# EAGLE design Control Board (EAGLE 7.6.0)
Control Board
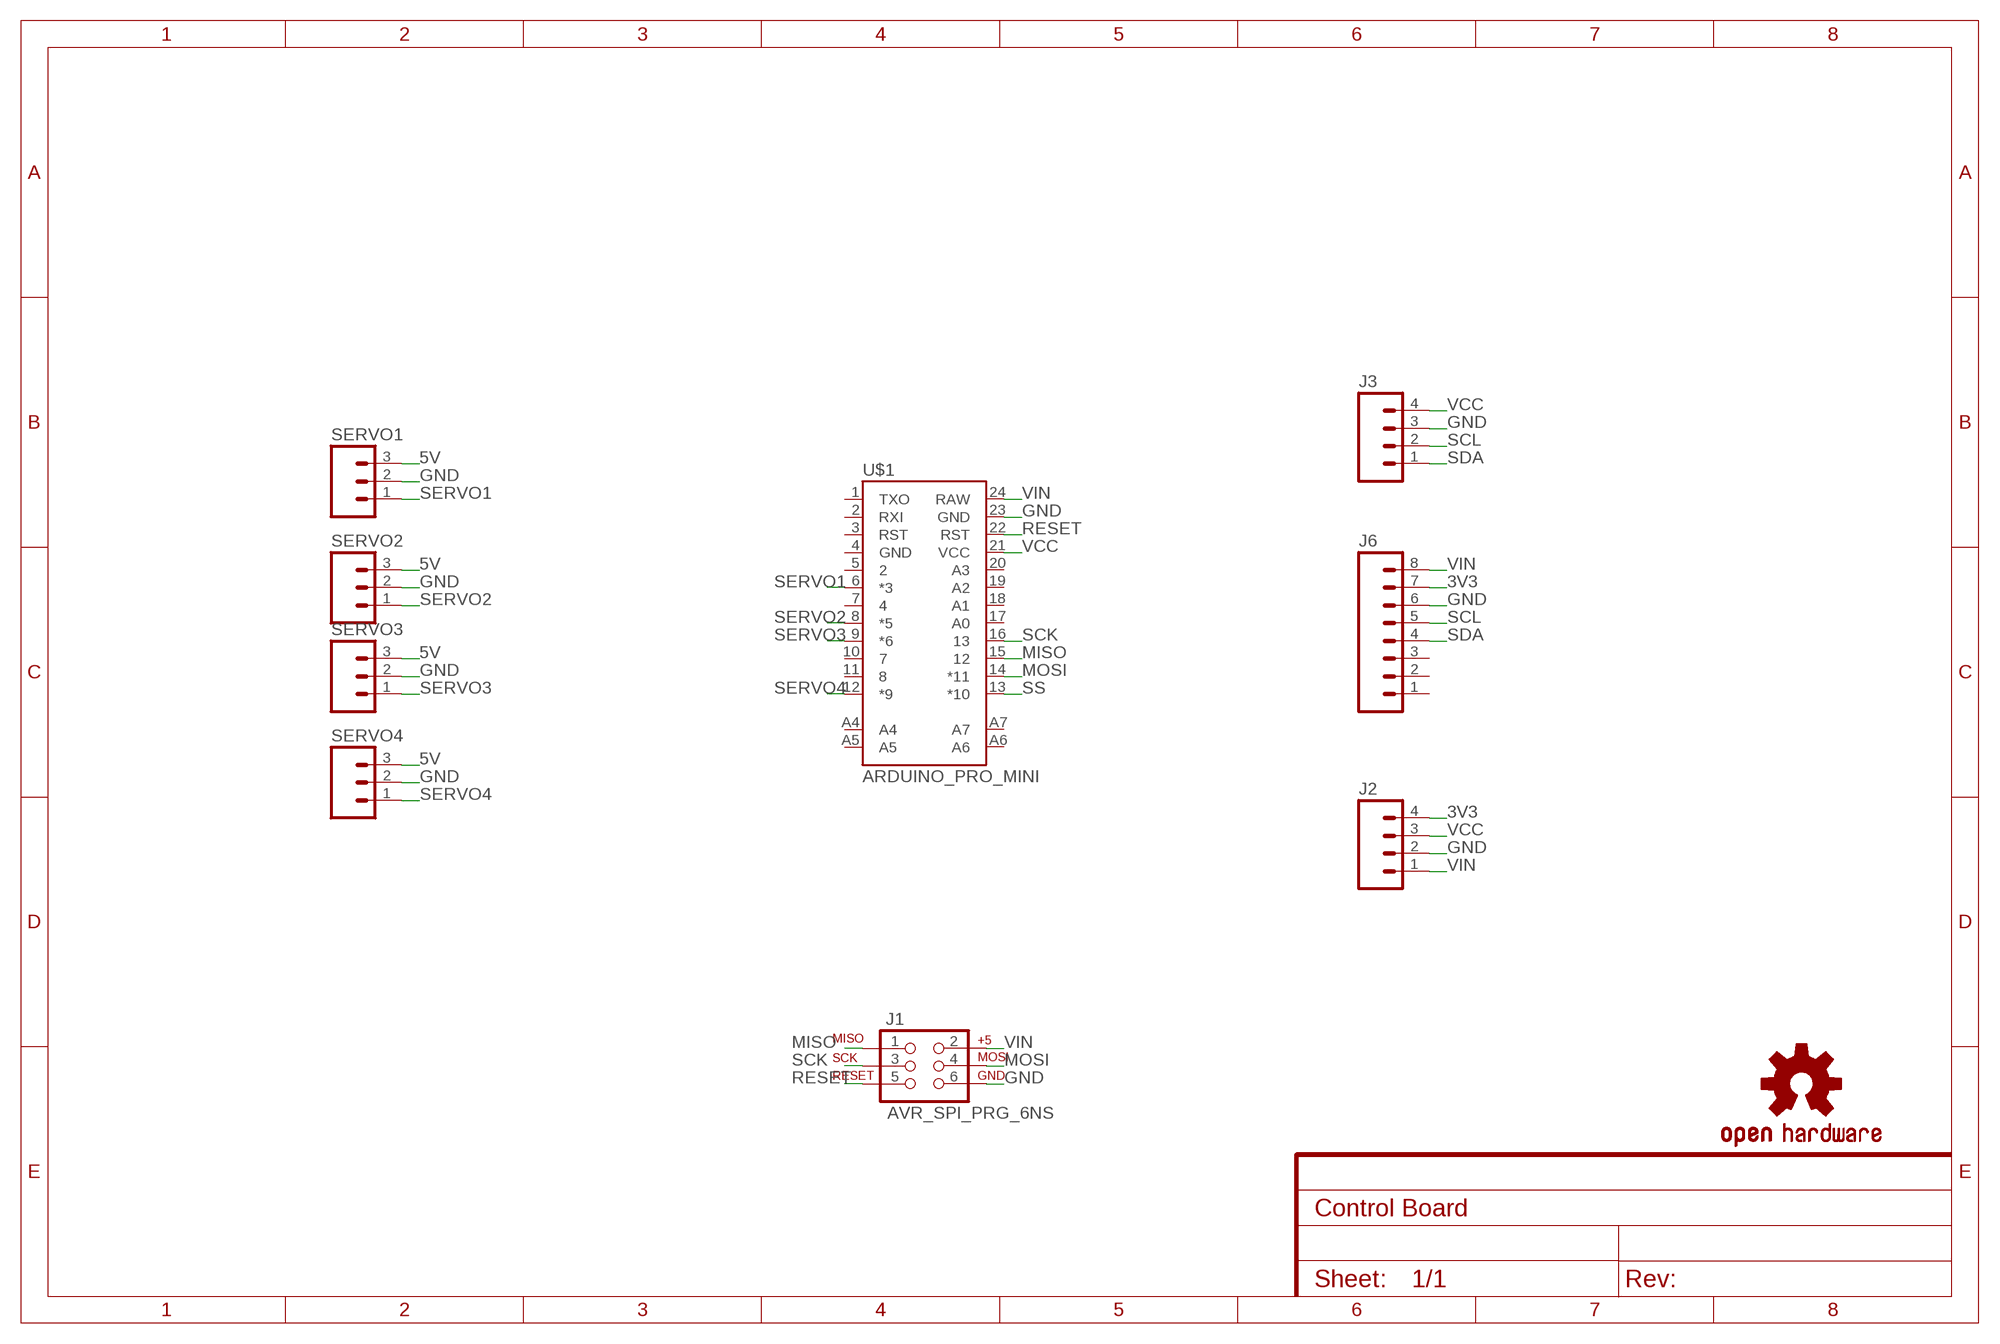
[diagram p0: schematic, sheet 1]

## Parts
J1  AVR_SPI_PRG_6NS  [2X3-NS]
J2  M04PTH  [1X04]
J3  M04PTH  [1X04]
J6  M08  [1X08_ROUND]
LOGO1  OSHW-LOGOM-COPPER  [OSHW-LOGO-M_COPPER]
SERVO1  M03PTH  [1X03]
SERVO2  M03PTH  [1X03]
SERVO3  M03PTH  [1X03]
SERVO4  M03PTH  [1X03]
U$1  ARDUINO_PRO_MINI  [ARDUINO_PRO_MINI]

## Nets
3V3: J2.4 J6.7
5V: SERVO1.3 SERVO2.3 SERVO3.3 SERVO4.3
GND: J1.6 J2.2 J3.3 J6.6 SERVO1.2 SERVO2.2 SERVO3.2 SERVO4.2 U$1.23(GND)
MISO: J1.1 U$1.15
MOSI: J1.4 U$1.14(*11)
RESET: J1.5 U$1.22(RST)
SCK: J1.3 U$1.16
SCL: J3.2 J6.5
SDA: J3.1 J6.4
SERVO1: SERVO1.1 U$1.6(*3)
SERVO2: SERVO2.1 U$1.8(*5)
SERVO3: SERVO3.1 U$1.9(*6)
SERVO4: SERVO4.1 U$1.12(*9)
SS: U$1.13(*10)
VCC: J2.3 J3.4 U$1.21(VCC)
VIN: J1.2 J2.1 J6.8 U$1.24(RAW)
Unconnected: J6.1 J6.2 J6.3 U$1.1(TXO) U$1.2(RXI) U$1.3(RST) U$1.4(GND) U$1.5 U$1.7 U$1.10 U$1.11 U$1.17(A0) U$1.18(A1) U$1.19(A2) U$1.20(A3) U$1.A4 U$1.A5 U$1.A6 U$1.A7

## Library data of the parts
J1 = SparkFun-Connectors:AVR_SPI_PRG_6: AVR ISP 6 Pin This is the reduced ISP connector for AVR programming. Common on Arduino. This footprint will take up less PCB space and can be used with a 10-pin to 6-pin adapter such as SKU: BOB-08508 **Special note about "TEST_POINT" package. The stop mask is on the top side, so if you want your programming test points to be on the bottom of your board, make sure to place this package on the bottom side of the board. This also ensure that the orientation to program from the bottom side will be correct.
J2 J3 = SparkFun-Connectors:M04: Header 4 Standard 4-pin 0.1" header. Use with straight break away headers (SKU : PRT-00116), right angle break away headers (PRT-00553), swiss pins (PRT-00743), machine pins (PRT-00117), and female headers (PRT-00115). Molex polarized connector foot print use with SKU : PRT-08231 with associated crimp pins and housings. 1MM SMD Version SKU: PRT-10208; PROD_ID: CONN-09696
J6 = SparkFun-Connectors:M08: Header 8 Standard 8-pin 0.1" header. Use with straight break away headers (SKU : PRT-00116), right angle break away headers (PRT-00553), swiss pins (PRT-00743), machine pins (PRT-00117), and female headers (PRT-00115).; PROD_ID: CONN-08437
LOGO1 = SparkFun-Aesthetics:OSHW-LOGO: Open Source Hardware Logo This logo indicates the piece of hardware it is found on incorporates a OSHW license and/or adheres to the definition of open source hardware found here: http://freedomdefined.org/OSHW
SERVO1-SERVO4 = SparkFun-Connectors:M03: Header 3 Standard 3-pin 0.1" header. Use with straight break away headers (SKU : PRT-00116), right angle break away headers (PRT-00553), swiss pins (PRT-00743), machine pins (PRT-00117), and female headers (PRT-00115). Molex polarized connector foot print use with SKU : PRT-08232 with associated crimp pins and housings.
U$1 = SparkFun-Boards:ARDUINO_PRO_MINI

## Board
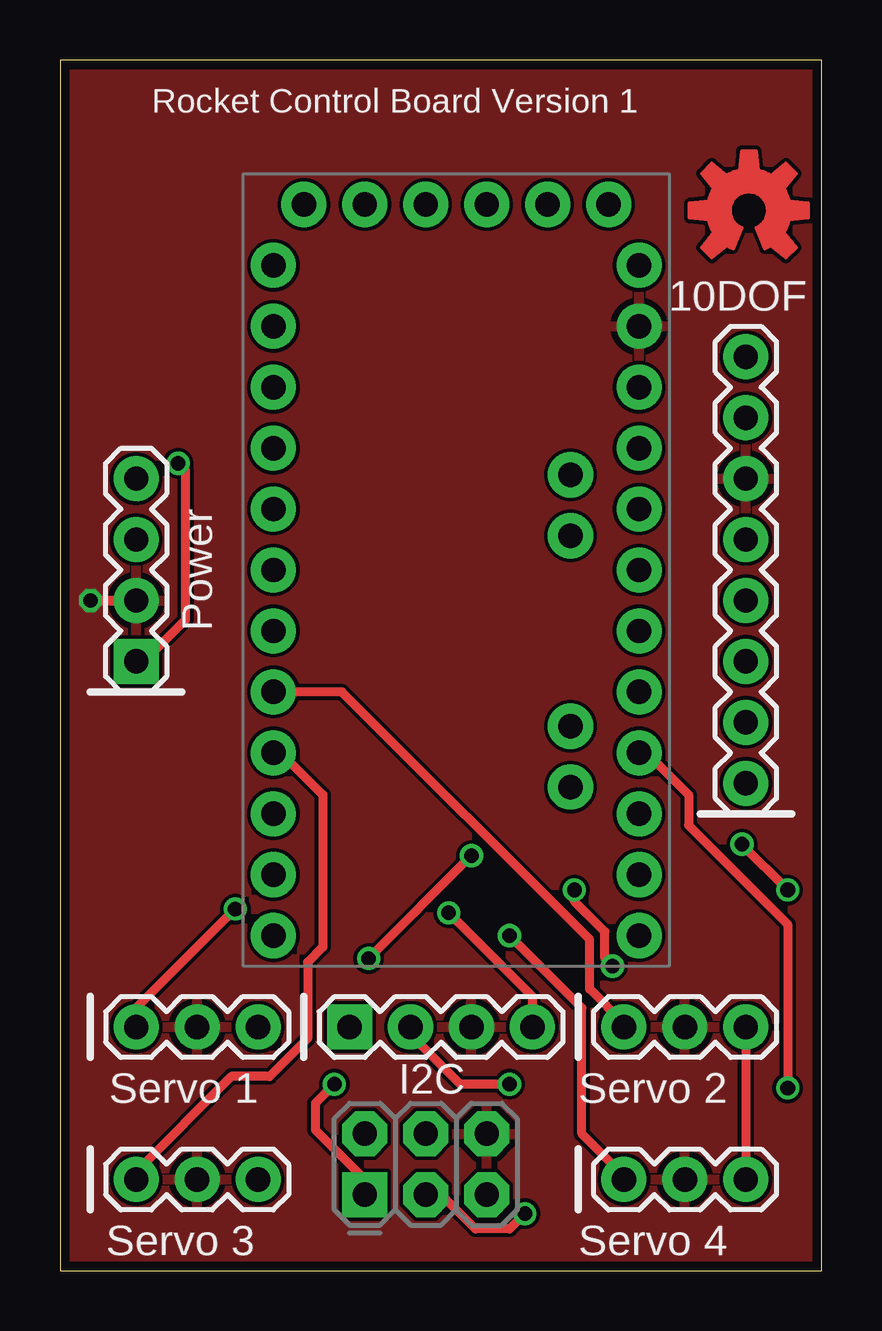
[diagram p1: board, top side]
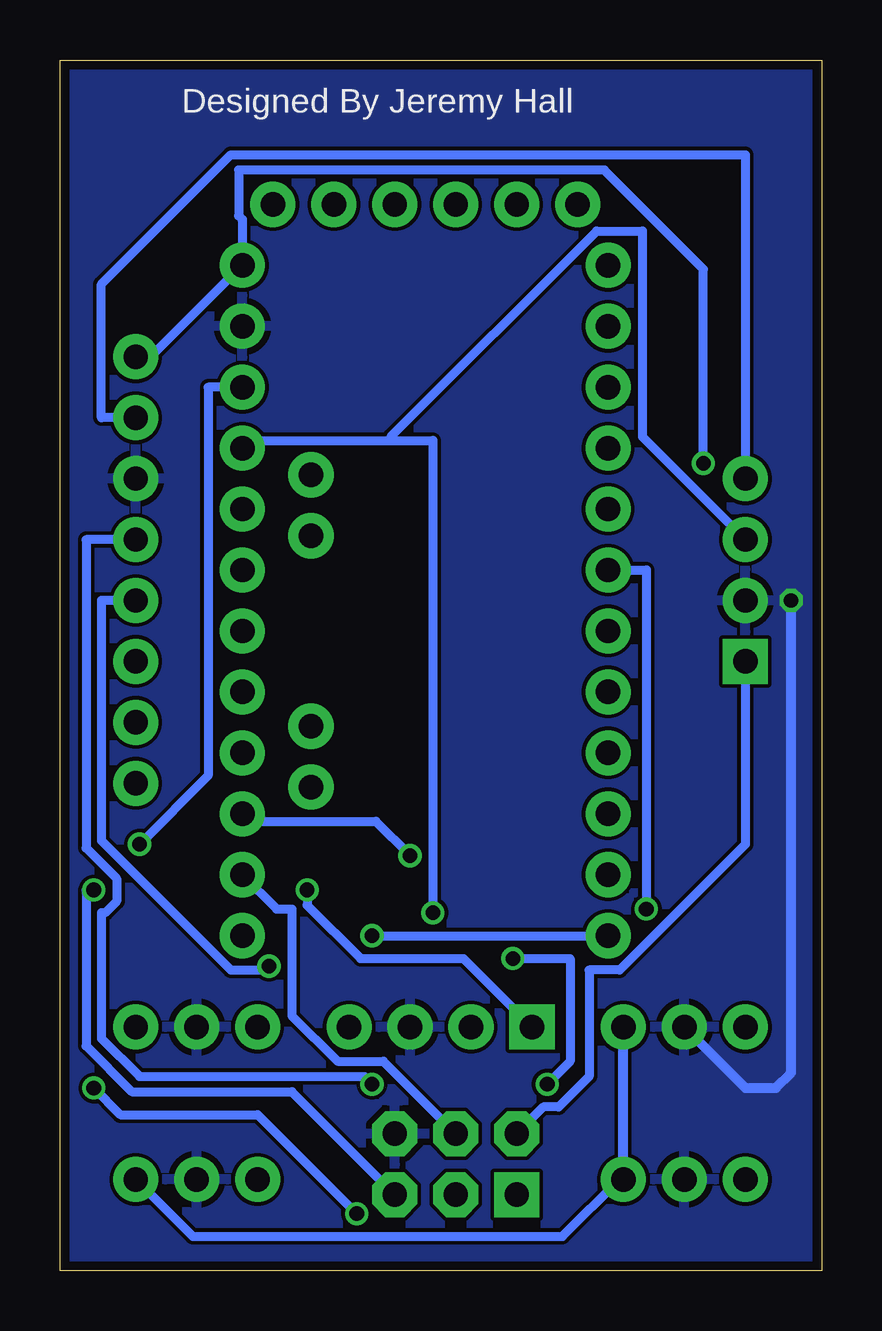
[diagram p2: board, bottom side, seen from below]

Size 31.73 x 50.47 mm. Coordinates in mm from the lower left corner, seen from the top.
Outline: 0,0 31.73,0 31.73,50.47 0,50.47 0,0
Copper layers (1*16): Top 0.0356mm / dielectric 1.5011mm / Bottom 0.0356mm
Design rules "oshpark-2layer": minimum track width 6mil, minimum drill 13mil, track to track 6mil, track to pad 6mil, pad to pad 6mil, via to via 6mil, smd to smd 6mil, copper to edge 15mil, drill to drill 6mil, minimum pad ring 7mil, minimum via ring 7mil, stop-mask expansion 2.5mil, vias tented up to drill 0mil, thermal gap 10mil

### Footprints (pad centres in the part's own frame; a part is rotated, then mirrored left to right if it is on the bottom)
2X3-NS = drill 1.016 pad 1.88 square: 1 -2.54,-1.27 | drill 1.016 pad 1.88 octagon: 2 -2.54,1.27; 3 0,-1.27; 4 0,1.27; 5 2.54,-1.27; 6 2.54,1.27
1X04 = drill 1.016 pad 1.88 square: 1 0,0 | drill 1.016 pad 1.88: 2 2.54,0; 3 5.08,0; 4 7.62,0
1X08_ROUND = drill 1.016 pad 1.88: 1 0,0; 2 2.54,0; 3 5.08,0; 4 7.62,0; 5 10.16,0; 6 12.7,0; 7 15.24,0; 8 17.78,0
1X03 = drill 1.016 pad 1.88: 1 0,0; 2 2.54,0; 3 5.08,0
ARDUINO_PRO_MINI = drill 1.016 pad 1.88: 1 -7.62,12.7; 2 -7.62,10.16; 3 -7.62,7.62; 4 -7.62,5.08; 5 -7.62,2.54; 6 -7.62,0; 7 -7.62,-2.54; 8 -7.62,-5.08; 9 -7.62,-7.62; 10 -7.62,-10.16; 11 -7.62,-12.7; 12 -7.62,-15.24; 13 7.62,-15.24; 14 7.62,-12.7; 15 7.62,-10.16; 16 7.62,-7.62; 17 7.62,-5.08; 18 7.62,-2.54; 19 7.62,0; 20 7.62,2.54; 21 7.62,5.08; 22 7.62,7.62; 23 7.62,10.16; 24 7.62,12.7; A4 4.763,1.429; A5 4.763,3.969; A6 4.763,-9.049; A7 4.763,-6.509; BLK -6.35,15.24; GND -3.81,15.24; GRN 6.35,15.24; RXI 1.27,15.24; TXO 3.81,15.24; VCC -1.27,15.24

### Placement (x,y rotation side)
J1  15.24,4.45 0 top
J2  3.17,25.4 90 top
J3  12.06,10.16 0 top
J6  28.57,20.32 90 top
LOGO1  28.7,44.2 0 top
SERVO1  3.17,10.16 0 top
SERVO2  23.5,10.16 0 top
SERVO3  3.17,3.81 0 top
SERVO4  23.5,3.81 0 top
U$1  16.51,29.21 0 top

### Tracks (layer width: path | path; a pad name or v marks a point on that pad's centre or on a via)
3V3
  Bottom 0.381: J2.4 3.17,46.51 24.61,46.51 30,41.12 30,35.56 J6.7
5V
  Top 0.381: SERVO2.3 SERVO4.3
  Bottom 0.381: SERVO4.3 26.19,1.43 10.79,1.43 8.41,3.81 SERVO3.3
  Bottom 0.406: SERVO3.3 SERVO1.3
GND  (via drill 0.6)
  Top 0.406: v1.27,27.94 J2.2
  Bottom 0.406: SERVO1.2 3.17,7.62 1.91,7.62 1.27,8.26 v1.27,27.94
  pour Top: 0,50.8 31.75,50.8 31.75,0 0,0
  pour Bottom: 0,50.8 31.75,50.8 31.75,0 0,0
MISO  (via drill 0.61)
  Top 0.381: J1.1 12.7,3.81 10.64,5.87 10.64,6.99 v11.43,7.78 | v17.14,17.3 v12.86,13.02
  Bottom 0.381: v11.43,7.78 10.48,8.73 10.48,13.02 v12.86,13.02 | v17.14,17.3 18.57,18.73 23.81,18.73 U$1.15
MOSI
  Bottom 0.381: J1.4 18.26,8.73 20.16,8.73 22.07,10.64 22.07,15.08 22.7,15.08 U$1.14
RESET  (via drill 0.61)
  Top 0.381: v28.42,17.78 v30.32,15.88
  Bottom 0.381: J1.5 22.07,7.46 28.73,7.46 30.64,9.37 30.64,15.88 v30.32,15.88 | v28.42,17.78 25.56,20.64 25.56,36.83 U$1.22
SCK  (via drill 0.61)
  Top 0.381: J1.3 15.88,3.17 17.3,1.75 18.73,1.75 v19.37,2.38 | v30.32,7.62 30.32,14.45 26.19,18.57 26.19,19.84 24.45,21.59 U$1.16
  Bottom 0.381: v19.37,2.38 23.5,6.51 29.21,6.51 v30.32,7.62
SCL  (via drill 0.61)
  Top 0.381: J3.2 14.61,9.84 16.67,7.78 v18.73,7.78
  Bottom 0.381: v18.73,7.78 19.05,8.1 28.42,8.1 30,9.68 30,14.92 29.84,14.92 29.37,15.4 29.37,16.35 30.64,17.62 30.64,30.48 J6.5
SDA  (via drill 0.61)
  Top 0.381: v21.43,15.88 21.43,15.4 22.7,14.13 22.7,13.02 v23.02,12.7
  Bottom 0.381: J3.1 14.92,13.02 19.21,13.02 21.43,15.24 v21.43,15.88 | v23.02,12.7 23.18,12.54 24.61,12.54 30,17.94 30,27.94 J6.4
SERVO1  (via drill 0.61)
  Top 0.381: SERVO1.1 3.17,10.95 v7.3,15.08
  Bottom 0.381: v7.3,15.08 7.3,29.21 U$1.6
SERVO2
  Top 0.381: U$1.8 11.75,24.13 22.07,13.81 22.07,11.75 23.5,10.32 SERVO2.1
SERVO3
  Top 0.381: SERVO3.1 3.17,4.13 7.14,8.1 8.73,8.1 10.32,9.68 10.32,12.86 10.95,13.49 10.95,19.84 9.21,21.59 U$1.9
SERVO4  (via drill 0.61)
  Top 0.381: v18.73,13.97 21.75,10.95 21.75,5.71 23.5,3.97 SERVO4.1
  Bottom 0.381: v18.73,13.97 U$1.12
VCC  (via drill 0.61)
  Top 0.381: J3.4 19.68,11.43 v16.19,14.92
  Bottom 0.381: v16.19,14.92 16.19,34.61 17.94,34.61 | 17.94,34.61 23.81,34.61 U$1.21 | J2.3 7.46,34.77 7.46,43.34 9.37,43.34 17.94,34.77 17.94,34.61
VIN  (via drill 0.61)
  Top 0.381: v4.92,33.66 5.24,33.34 5.24,27.15 3.49,25.4 J2.1
  Bottom 0.381: J6.8 27.94,38.1 U$1.24 24.13,43.81 24.29,43.97 24.29,45.88 9.05,45.88 4.92,41.75 v4.92,33.66 | J1.2 11.59,6.83 10.95,6.83 9.68,8.1 9.68,12.54 8.41,12.54 3.17,17.78 J2.1

### Text on the board
tPlace: Rocket Control Board Version 1 | 10DOF | Power | Servo 1 | I2C | Servo 2 | Servo 3 | Servo 4
bPlace: Designed By Jeremy Hall